# EAGLE schematic FPGA Test Board (EAGLE 9.2.0)
CREVISION: A; DESIGNER: Luis Ernesto Fdez

## Sheet 1 of 4: Comunication Interface
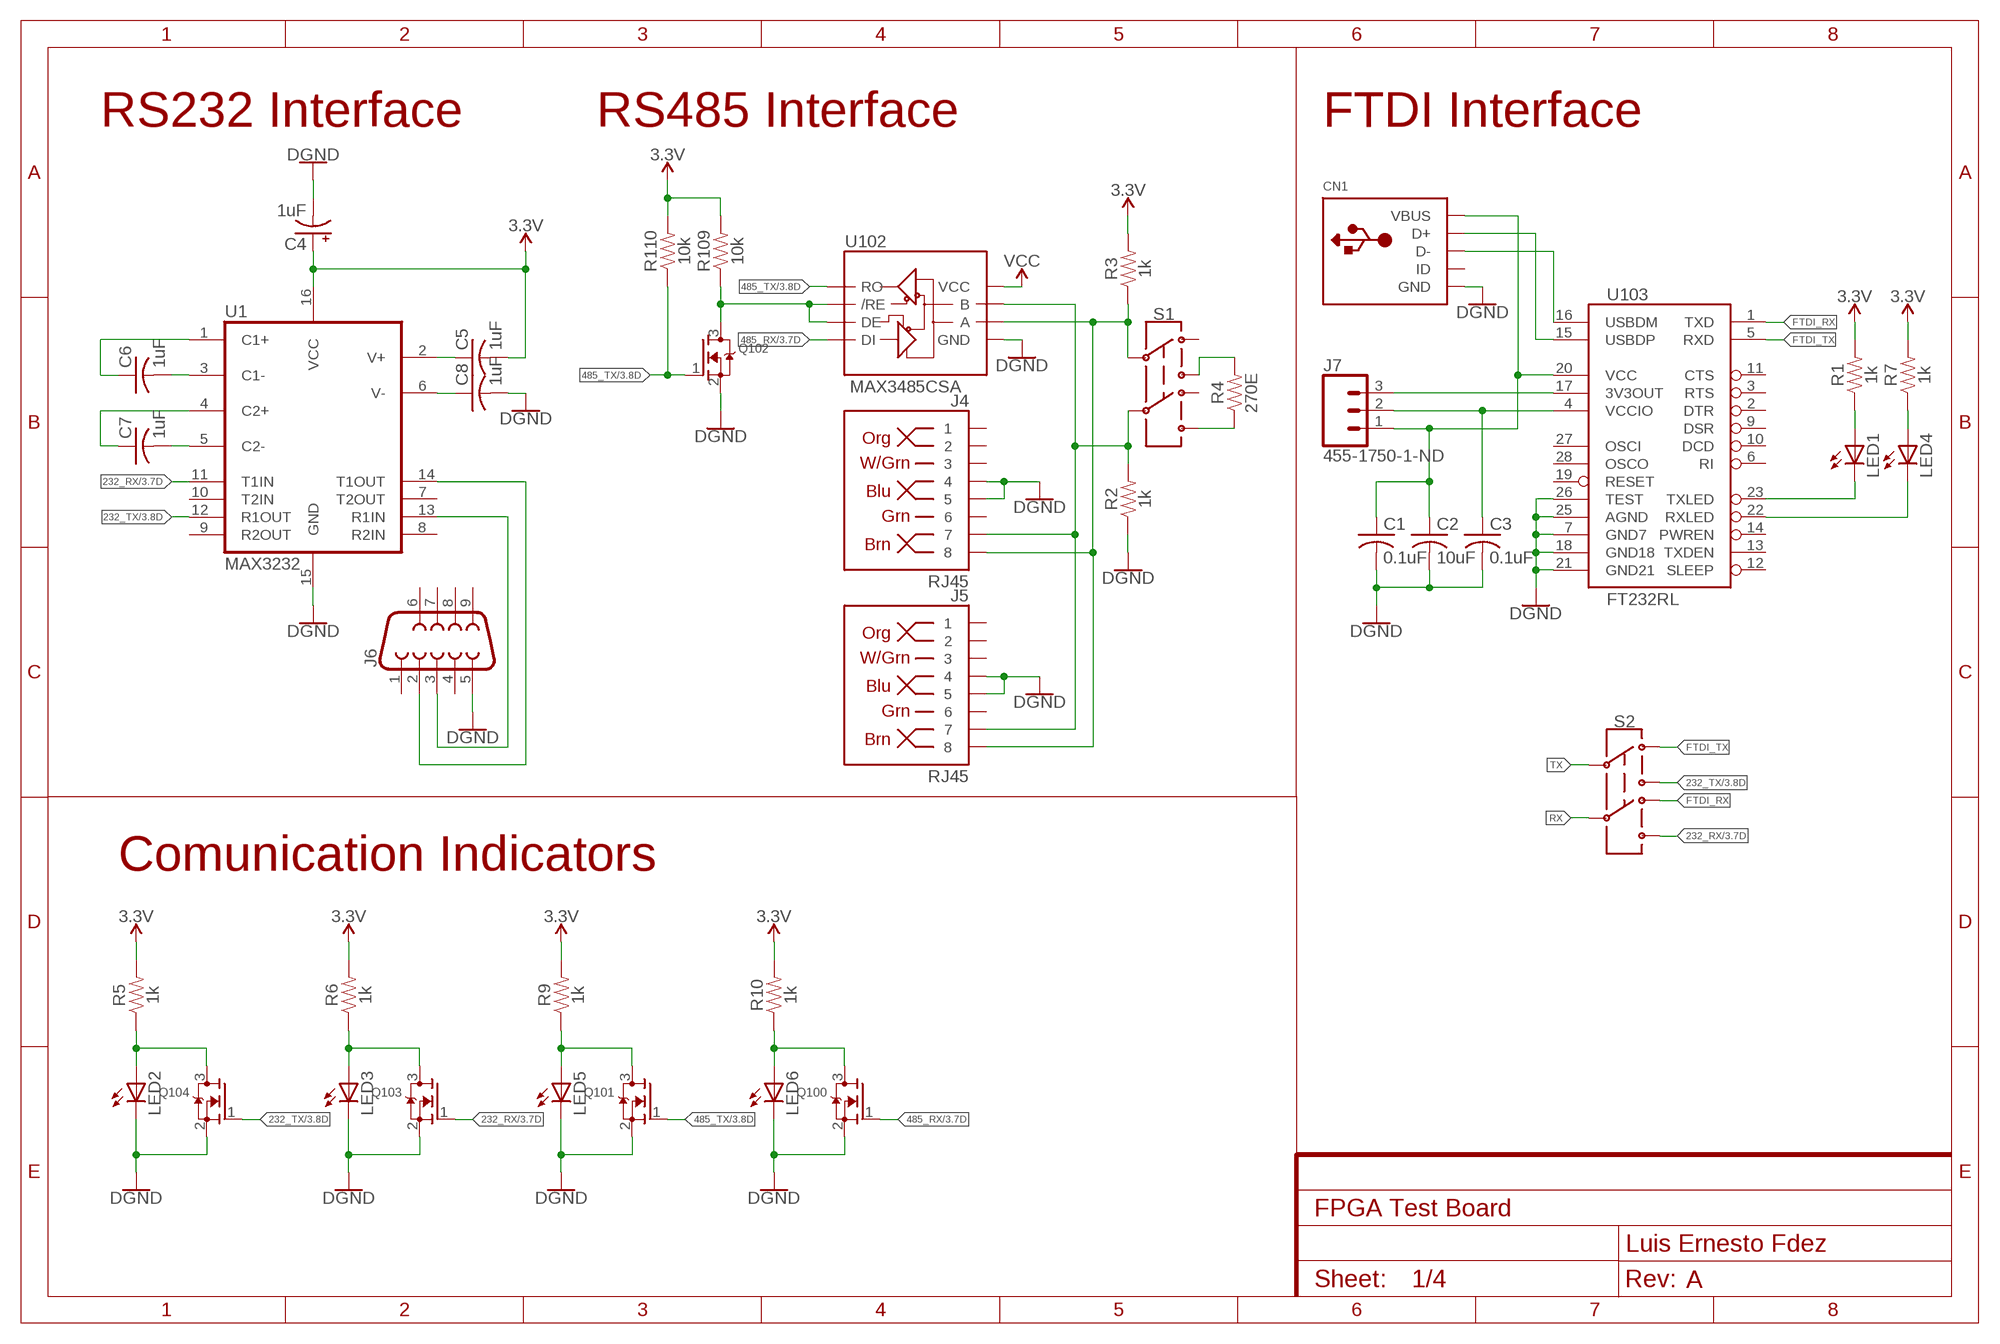
[diagram p0: schematic, sheet 1]

### Parts
C1  0.1uF  C-USC0805  [C0805]
C2  10uF  C-USC0805  [C0805]
C3  0.1uF  C-USC0805  [C0805]
C4  1uF  CPOL-USB  [PANASONIC_B]
C5  1uF  C-USC0805  [C0805]
C6  1uF  C-USC0805  [C0805]
C7  1uF  C-USC0805  [C0805]
C8  1uF  C-USC0805  [C0805]
CN1  USBMINIB  [USB-MINIB]
J4  RJ45  RJ45-8  [RJ45-8]
J5  RJ45  RJ45-8  [RJ45-8]
J6  DB9FEMALE  [DB9]
J7  455-1750-1-ND  CONN_03  [1X03]
LED1  LEDCHIP-LED0805  [CHIP-LED0805]
LED2  LEDCHIP-LED0805  [CHIP-LED0805]
LED3  LEDCHIP-LED0805  [CHIP-LED0805]
LED4  LEDCHIP-LED0805  [CHIP-LED0805]
LED5  LEDCHIP-LED0805  [CHIP-LED0805]
LED6  LEDCHIP-LED0805  [CHIP-LED0805]
Q100  MOSFET-NWAVE  [SOT23-W]
Q101  MOSFET-NWAVE  [SOT23-W]
Q102  MOSFET-NWAVE  [SOT23-W]
Q103  MOSFET-NWAVE  [SOT23-W]
Q104  MOSFET-NWAVE  [SOT23-W]
R1  1k  RESISTOR0805  [0805]
R2  1k  RESISTOR0805  [0805]
R3  1k  RESISTOR0805  [0805]
R4  270E  RESISTOR0805  [0805]
R5  1k  RESISTOR0805  [0805]
R6  1k  RESISTOR0805  [0805]
R7  1k  RESISTOR0805  [0805]
R9  1k  RESISTOR0805  [0805]
R10  1k  RESISTOR0805  [0805]
R109  10k  RESISTOR0805  [0805]
R110  10k  RESISTOR0805  [0805]
S1  SWITCH-DPDT-SMD-AYZ0202  [SWITCH_DPDT_SMD_AYZ0202]
S2  SWITCH-DPDT-SMD-AYZ0202  [SWITCH_DPDT_SMD_AYZ0202]
U1  MAX3232  MAX2323SOIC16  [SO16]
U102  MAX3485CSA  RS485SOIC  [SO08]
U103  FT232RL  FT232RLSSOP  [SSOP28DB]

### Nets
3.3V: C4.+ C5.2 R1.2 R3.2 R5.2 R6.2 R7.2 R9.2 R10.2 R109.2 R110.2 U1.16(VCC) ; also sheet 2,3,4
5V: U102.8(VCC) ; supply symbol labelled VCC ; also sheet 2,3,4
232_RX: Q103.1(G) S2.6 U1.11(T1IN) ; also sheet 3
232_TX: Q104.1(G) S2.3 U1.12(R1OUT) ; also sheet 3
485_RX: Q100.1(G) U102.4(DI) ; also sheet 3
485_TX: Q101.1(G) Q102.1(G) R110.1 U102.1(RO) ; also sheet 3
FTDI_RX: S2.4 U103.1(TXD)
FTDI_TX: S2.1 U103.5(RXD)
GND: C1.2 C2.2 C3.2 C4.- C8.2 CN1.GND J4.4 J4.5 J5.4 J5.5 J6.5 LED2.C LED3.C LED5.C LED6.C Q100.2(S) Q101.2(S) Q102.2(S) Q103.2(S) Q104.2(S) R2.1 U1.15(GND) U102.5(GND) U103.7(GND7) U103.18(GND18) U103.21(GND21) U103.25(AGND) U103.26(TEST) ; supply symbol labelled DGND ; also sheet 2,3
N$1: C6.2 U1.3(C1-)
N$2: C5.1 U1.2(V+)
N$3: C6.1 U1.1(C1+)
N$4: C7.1 U1.4(C2+)
N$5: C7.2 U1.5(C2-)
N$6: C8.1 U1.6(V-)
N$7: J4.8 J5.8 R3.1 S1.2 U102.6(A)
N$8: LED3.A Q103.3(D) R6.1
N$9: J6.2 U1.14(T1OUT)
N$10: J6.3 U1.13(R1IN)
N$11: LED5.A Q101.3(D) R9.1
N$12: LED2.A Q104.3(D) R5.1
N$13: LED6.A Q100.3(D) R10.1
N$14: J4.7 J5.7 R2.2 S1.5 U102.7(B)
N$15: R4.1 S1.6
N$16: Q102.3(D) R109.1 U102.2(/RE) U102.3(DE)
N$17: R4.2 S1.3
N$32: C1.1 C2.1 CN1.VBUS J7.1 U103.20(VCC)
N$34: LED1.A R1.1
N$35: LED1.C U103.23(TXLED)
N$36: LED4.A R7.1
N$46: LED4.C U103.22(RXLED)
N$47: CN1.D- U103.16(USBDM)
N$48: CN1.D+ U103.15(USBDP)
N$49: J7.3 U103.17(3V3OUT)
N$50: C3.1 J7.2 U103.4(VCCIO)
RX: S2.5
TX: S2.2
Unconnected: CN1.ID J4.1 J4.2 J4.3 J4.6 J5.1 J5.2 J5.3 J5.6 J6.1 J6.4 J6.6 J6.7 J6.8 J6.9 S1.1 S1.4 U1.7(T2OUT) U1.8(R2IN) U1.9(R2OUT) U1.10(T2IN) U103.2(DTR) U103.3(RTS) U103.6(RI) U103.9(DSR) U103.10(DCD) U103.11(CTS) U103.12(SLEEP) U103.13(TXDEN) U103.14(PWREN) U103.19(RESET) U103.27(OSCI) U103.28(OSCO)

### Notes on the sheet
- RS232 Interface | RS485 Interface | FTDI Interface
- Comunication Indicators

## Sheet 2 of 4: Input/Output Interface
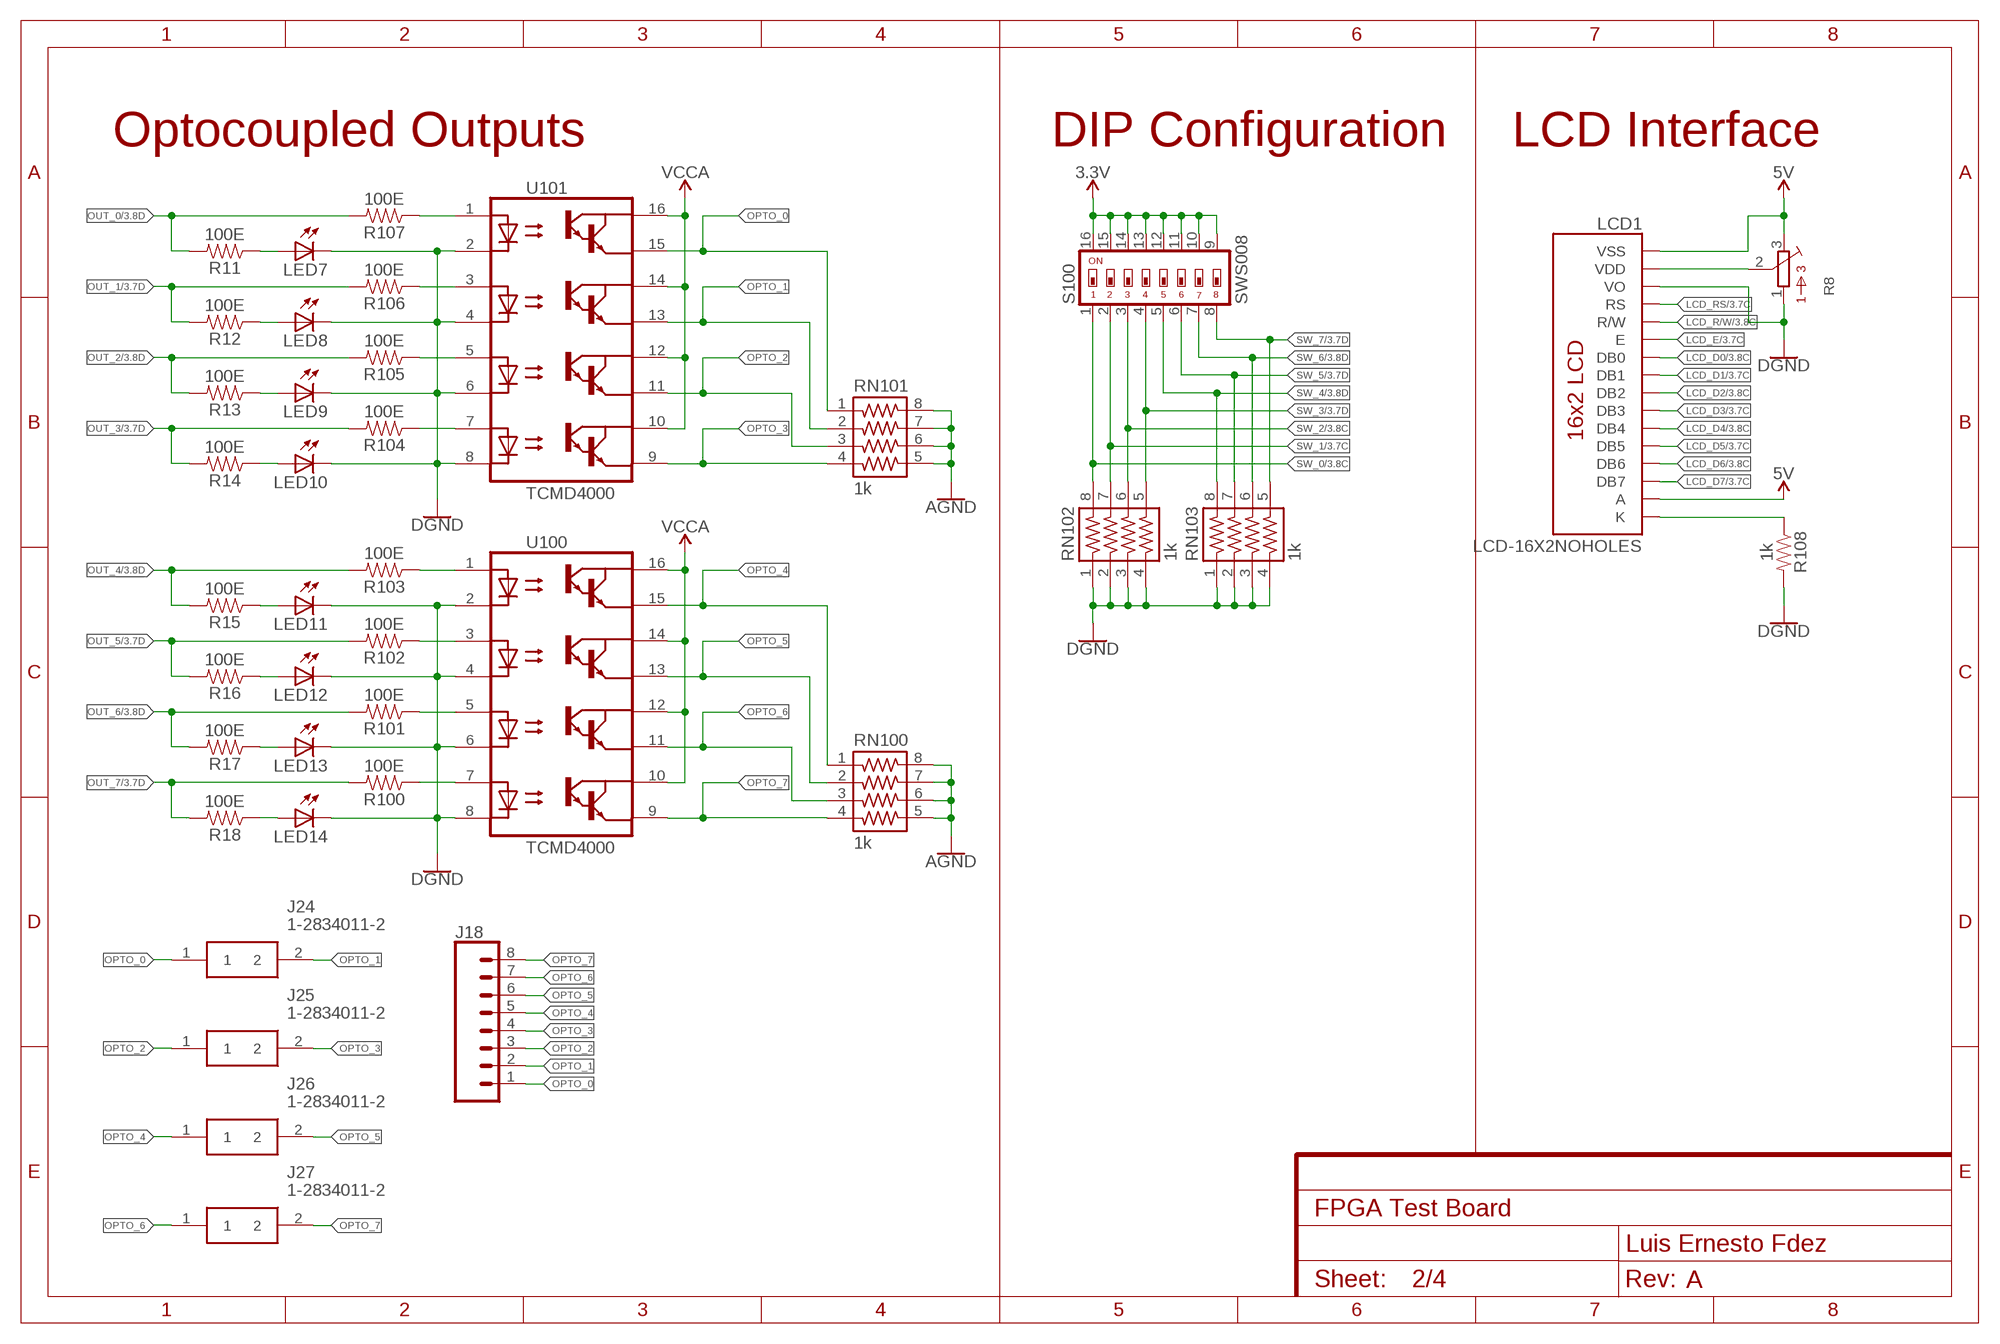
[diagram p1: schematic, sheet 2]

### Parts
J18  CONN_08FEMALE_LOCK  [1X08_FEMALE_LOCK]
J24  1-2834011-2  [128340112]
J25  1-2834011-2  [128340112]
J26  1-2834011-2  [128340112]
J27  1-2834011-2  [128340112]
LCD1  LCD-16X2NOHOLES  [LCD-16X2_NOHOLESNOSILK]
LED7  LEDCHIP-LED0805  [CHIP-LED0805]
LED8  LEDCHIP-LED0805  [CHIP-LED0805]
LED9  LEDCHIP-LED0805  [CHIP-LED0805]
LED10  LEDCHIP-LED0805  [CHIP-LED0805]
LED11  LEDCHIP-LED0805  [CHIP-LED0805]
LED12  LEDCHIP-LED0805  [CHIP-LED0805]
LED13  LEDCHIP-LED0805  [CHIP-LED0805]
LED14  LEDCHIP-LED0805  [CHIP-LED0805]
R8  3386-P  [3386P]
R11  100E  RESISTOR0805  [0805]
R12  100E  RESISTOR0805  [0805]
R13  100E  RESISTOR0805  [0805]
R14  100E  RESISTOR0805  [0805]
R15  100E  RESISTOR0805  [0805]
R16  100E  RESISTOR0805  [0805]
R17  100E  RESISTOR0805  [0805]
R18  100E  RESISTOR0805  [0805]
R100  100E  RESISTOR0805  [0805]
R101  100E  RESISTOR0805  [0805]
R102  100E  RESISTOR0805  [0805]
R103  100E  RESISTOR0805  [0805]
R104  100E  RESISTOR0805  [0805]
R105  100E  RESISTOR0805  [0805]
R106  100E  RESISTOR0805  [0805]
R107  100E  RESISTOR0805  [0805]
R108  1k  RESISTOR0805  [0805]
RN100  1k  743-8NS  [743-8NS]
RN101  1k  743-8NS  [743-8NS]
RN102  1k  743-8NS  [743-8NS]
RN103  1k  743-8NS  [743-8NS]
S100  SWS008  [SMS-008]
U100  TCMD4000  [SOIC127P686X201-16N]
U101  TCMD4000  [SOIC127P686X201-16N]

### Nets
3.3V: S100.9 S100.10 S100.11 S100.12 S100.13 S100.14 S100.15 S100.16 ; also sheet 1,3,4
5V: LCD1.1(VSS) LCD1.15(A) R8.3 ; also sheet 1,3,4
AGND: RN100.5 RN100.6 RN100.7 RN100.8 RN101.5 RN101.6 RN101.7 RN101.8 ; also sheet 4
GND: LCD1.3(VO) LED7.C LED8.C LED9.C LED10.C LED11.C LED12.C LED13.C LED14.C R8.1 R108.2 RN102.1 RN102.2 RN102.3 RN102.4 RN103.1 RN103.2 RN103.3 RN103.4 U100.2(C1) U100.4(C2) U100.6(C3) U100.8(C4) U101.2(C1) U101.4(C2) U101.6(C3) U101.8(C4) ; supply symbol labelled DGND ; also sheet 1,3
LCD_D0: LCD1.7(DB0) ; also sheet 3
LCD_D1: LCD1.8(DB1) ; also sheet 3
LCD_D2: LCD1.9(DB2) ; also sheet 3
LCD_D3: LCD1.10(DB3) ; also sheet 3
LCD_D4: LCD1.11(DB4) ; also sheet 3
LCD_D5: LCD1.12(DB5) ; also sheet 3
LCD_D6: LCD1.13(DB6) ; also sheet 3
LCD_D7: LCD1.14(DB7) ; also sheet 3
LCD_E: LCD1.6(E) ; also sheet 3
LCD_R/W: LCD1.5(R/W) ; also sheet 3
LCD_RS: LCD1.4(RS) ; also sheet 3
N$18: LCD1.2(VDD) R8.2
N$19: LCD1.16(K) R108.1
N$20: R107.1 U101.1(A1)
N$21: R106.1 U101.3(A2)
N$22: R105.1 U101.5(A3)
N$23: R104.1 U101.7(A4)
N$25: LED10.A R14.1
N$26: LED9.A R13.1
N$27: LED8.A R12.1
N$28: LED7.A R11.1
N$33: R103.1 U100.1(A1)
N$39: R102.1 U100.3(A2)
N$40: R101.1 U100.5(A3)
N$41: R100.1 U100.7(A4)
N$42: LED14.A R18.1
N$43: LED13.A R17.1
N$44: LED12.A R16.1
N$45: LED11.A R15.1
OPTO_0: J18.1 J24.1 RN101.1 U101.15(E1)
OPTO_1: J18.2 J24.2 RN101.2 U101.13(E2)
OPTO_2: J18.3 J25.1 RN101.3 U101.11(E3)
OPTO_3: J18.4 J25.2 RN101.4 U101.9(E4)
OPTO_4: J18.5 J26.1 RN100.1 U100.15(E1)
OPTO_5: J18.6 J26.2 RN100.2 U100.13(E2)
OPTO_6: J18.7 J27.1 RN100.3 U100.11(E3)
OPTO_7: J18.8 J27.2 RN100.4 U100.9(E4)
OUT_0: R11.2 R107.2 ; also sheet 3
OUT_1: R12.2 R106.2 ; also sheet 3
OUT_2: R13.2 R105.2 ; also sheet 3
OUT_3: R14.2 R104.2 ; also sheet 3
OUT_4: R15.2 R103.2 ; also sheet 3
OUT_5: R16.2 R102.2 ; also sheet 3
OUT_6: R17.2 R101.2 ; also sheet 3
OUT_7: R18.2 R100.2 ; also sheet 3
SW_0: RN102.8 S100.1 ; also sheet 3
SW_1: RN102.7 S100.2 ; also sheet 3
SW_2: RN102.6 S100.3 ; also sheet 3
SW_3: RN102.5 S100.4 ; also sheet 3
SW_4: RN103.8 S100.5 ; also sheet 3
SW_5: RN103.7 S100.6 ; also sheet 3
SW_6: RN103.6 S100.7 ; also sheet 3
SW_7: RN103.5 S100.8 ; also sheet 3
VCCA: U100.10(CO4) U100.12(CO3) U100.14(CO2) U100.16(CO1) U101.10(CO4) U101.12(CO3) U101.14(CO2) U101.16(CO1) ; also sheet 4

### Notes on the sheet
- Optocoupled Outputs | DIP Configuration | LCD Interface

## Sheet 3 of 4: ADC & External I/O
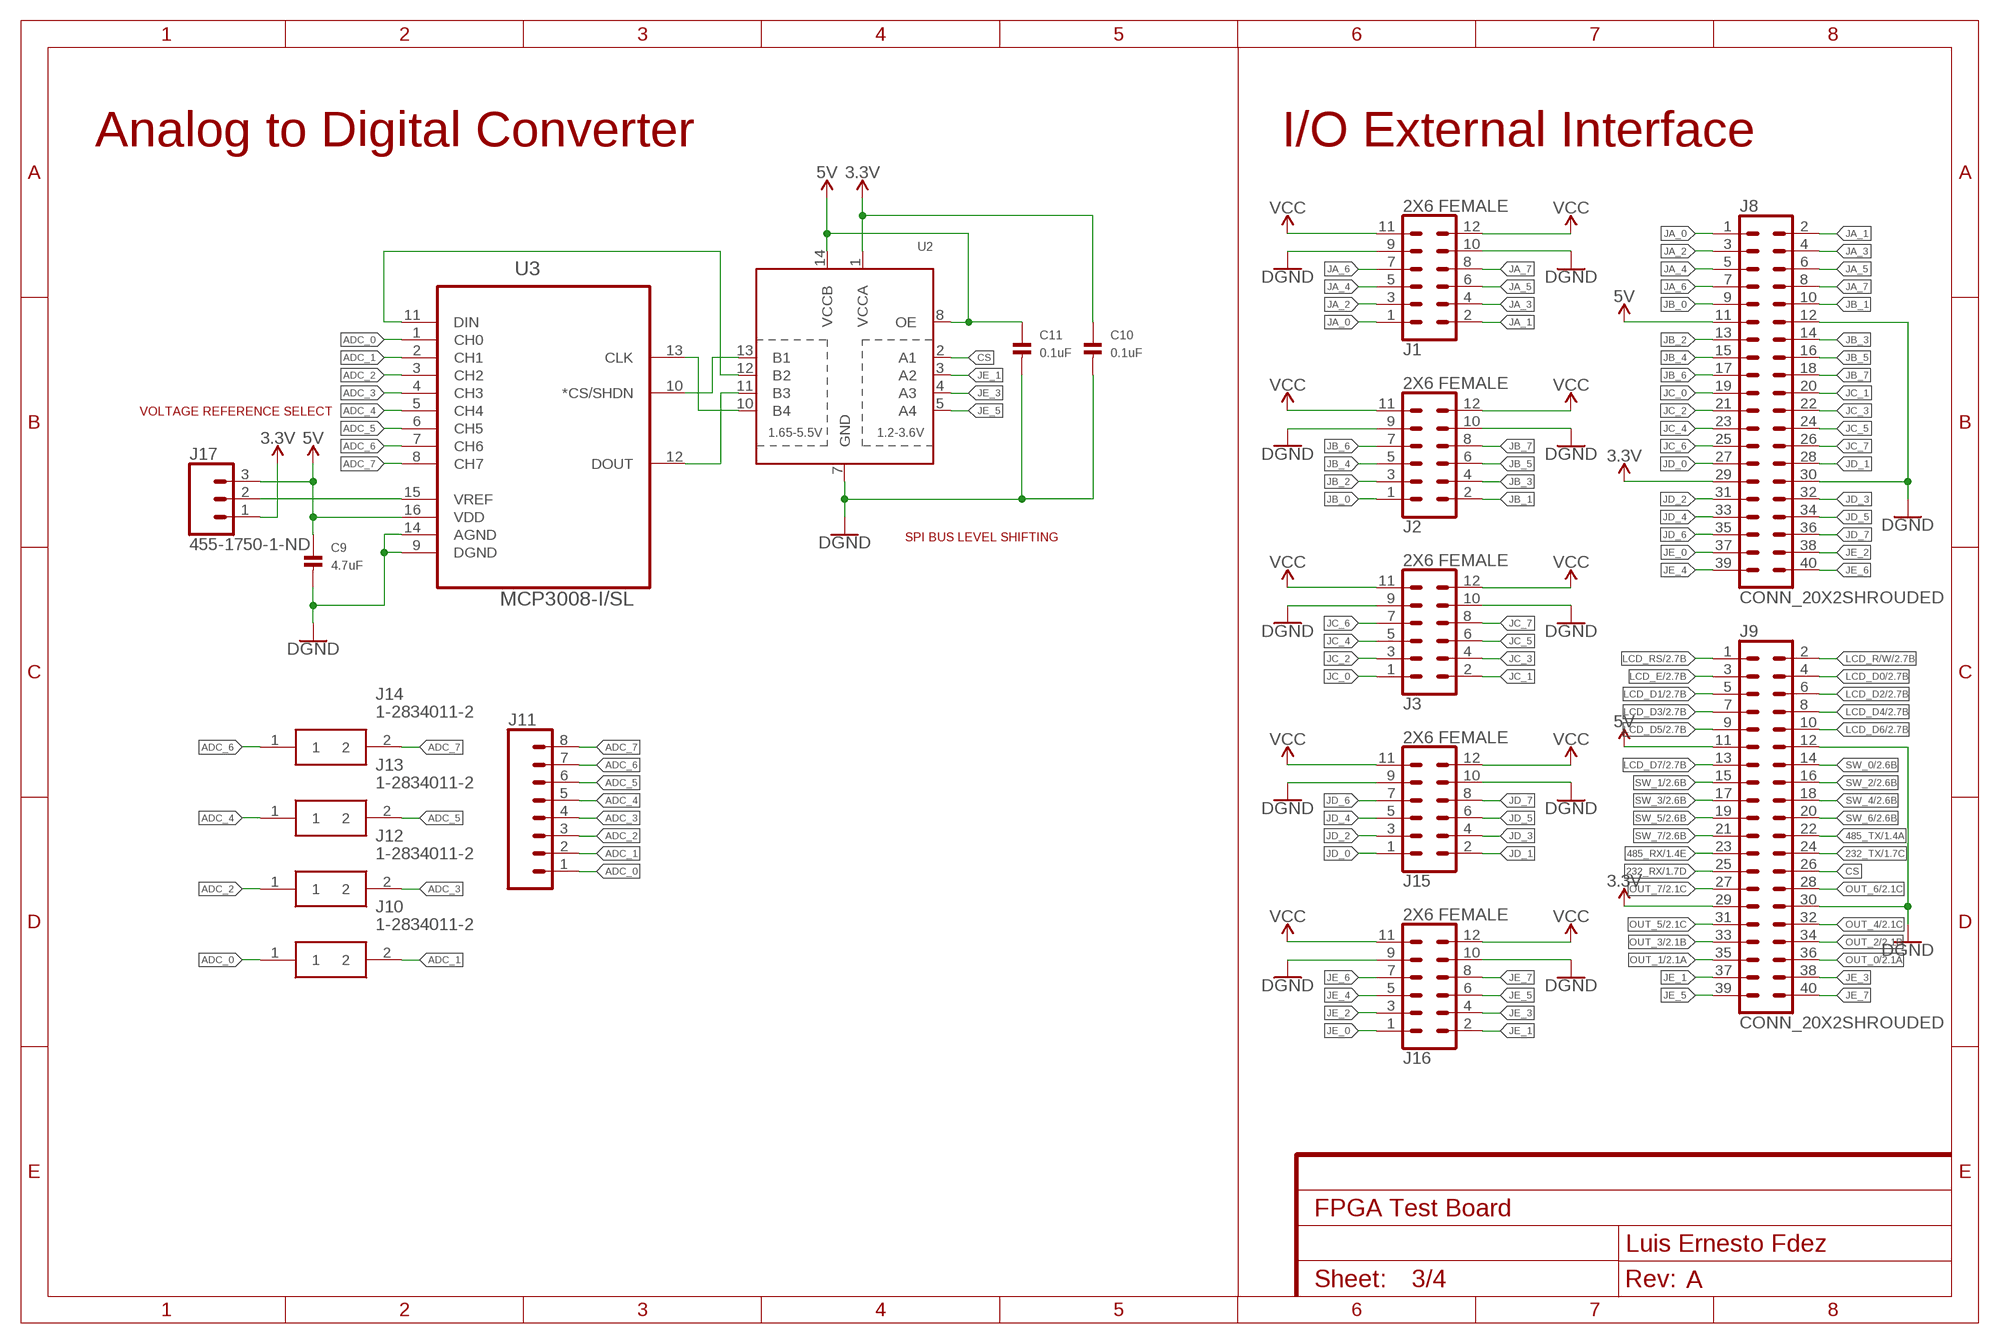
[diagram p2: schematic, sheet 3]

### Parts
C9  4.7uF  CAP_CERAMIC0805-NOTHERMALS  [0805_NOTHERMALS]
C10  0.1uF  CAP_CERAMIC0805-NOTHERMALS  [0805_NOTHERMALS]
C11  0.1uF  CAP_CERAMIC0805-NOTHERMALS  [0805_NOTHERMALS]
J1  2X6 FEMALE  CONN_06X2PTH_FEMALE  [2X6]
J2  2X6 FEMALE  CONN_06X2PTH_FEMALE  [2X6]
J3  2X6 FEMALE  CONN_06X2PTH_FEMALE  [2X6]
J8  CONN_20X2SHROUDED  [2X20_SHROUDED]
J9  CONN_20X2SHROUDED  [2X20_SHROUDED]
J10  1-2834011-2  [128340112]
J11  CONN_08FEMALE_LOCK  [1X08_FEMALE_LOCK]
J12  1-2834011-2  [128340112]
J13  1-2834011-2  [128340112]
J14  1-2834011-2  [128340112]
J15  2X6 FEMALE  CONN_06X2PTH_FEMALE  [2X6]
J16  2X6 FEMALE  CONN_06X2PTH_FEMALE  [2X6]
J17  455-1750-1-ND  CONN_03  [1X03]
U2  TXB0104PWR  [TSSOP14]
U3  MCP3008-I/SL  [SOIC127P600X175-16N]

### Nets
3.3V: C10.1 J8.29 J9.29 J17.1 U2.1(VCCA) ; also sheet 1,2,4
5V: C9.1 C11.1 J8.11 J9.11 J17.3 U2.8(OE) U2.14(VCCB) U3.16(VDD) ; also sheet 1,2,4
232_RX: J9.25 ; also sheet 1
232_TX: J9.24 ; also sheet 1
485_RX: J9.23 ; also sheet 1
485_TX: J9.22 ; also sheet 1
ADC_0: J10.1 J11.1 U3.1(CH0)
ADC_1: J10.2 J11.2 U3.2(CH1)
ADC_2: J11.3 J12.1 U3.3(CH2)
ADC_3: J11.4 J12.2 U3.4(CH3)
ADC_4: J11.5 J13.1 U3.5(CH4)
ADC_5: J11.6 J13.2 U3.6(CH5)
ADC_6: J11.7 J14.1 U3.7(CH6)
ADC_7: J11.8 J14.2 U3.8(CH7)
CS: J9.26 U2.2(A1)
GND: C9.2 C10.2 C11.2 J1.9 J1.10 J2.9 J2.10 J3.9 J3.10 J8.12 J8.30 J9.12 J9.30 J15.9 J15.10 J16.9 J16.10 U2.7(GND) U3.9(DGND) U3.14(AGND) ; supply symbol labelled DGND ; also sheet 1,2
JA_0: J1.1 J8.1
JA_1: J1.2 J8.2
JA_2: J1.3 J8.3
JA_3: J1.4 J8.4
JA_4: J1.5 J8.5
JA_5: J1.6 J8.6
JA_6: J1.7 J8.7
JA_7: J1.8 J8.8
JB_0: J2.1 J8.9
JB_1: J2.2 J8.10
JB_2: J2.3 J8.13
JB_3: J2.4 J8.14
JB_4: J2.5 J8.15
JB_5: J2.6 J8.16
JB_6: J2.7 J8.17
JB_7: J2.8 J8.18
JC_0: J3.1 J8.19
JC_1: J3.2 J8.20
JC_2: J3.3 J8.21
JC_3: J3.4 J8.22
JC_4: J3.5 J8.23
JC_5: J3.6 J8.24
JC_6: J3.7 J8.25
JC_7: J3.8 J8.26
JD_0: J8.27 J15.1
JD_1: J8.28 J15.2
JD_2: J8.31 J15.3
JD_3: J8.32 J15.4
JD_4: J8.33 J15.5
JD_5: J8.34 J15.6
JD_6: J8.35 J15.7
JD_7: J8.36 J15.8
JE_0: J8.37 J16.1
JE_1: J9.37 J16.2 U2.3(A2)
JE_2: J8.38 J16.3
JE_3: J9.38 J16.4 U2.4(A3)
JE_4: J8.39 J16.5
JE_5: J9.39 J16.6 U2.5(A4)
JE_6: J8.40 J16.7
JE_7: J9.40 J16.8
LCD_D0: J9.4 ; also sheet 2
LCD_D1: J9.5 ; also sheet 2
LCD_D2: J9.6 ; also sheet 2
LCD_D3: J9.7 ; also sheet 2
LCD_D4: J9.8 ; also sheet 2
LCD_D5: J9.9 ; also sheet 2
LCD_D6: J9.10 ; also sheet 2
LCD_D7: J9.13 ; also sheet 2
LCD_E: J9.3 ; also sheet 2
LCD_R/W: J9.2 ; also sheet 2
LCD_RS: J9.1 ; also sheet 2
N$24: U2.13(B1) U3.10(*CS/SHDN)
N$29: U2.10(B4) U3.13(CLK)
N$31: U2.11(B3) U3.12(DOUT)
N$94: U2.12(B2) U3.11(DIN)
N$112: J17.2 U3.15(VREF)
OUT_0: J9.36 ; also sheet 2
OUT_1: J9.35 ; also sheet 2
OUT_2: J9.34 ; also sheet 2
OUT_3: J9.33 ; also sheet 2
OUT_4: J9.32 ; also sheet 2
OUT_5: J9.31 ; also sheet 2
OUT_6: J9.28 ; also sheet 2
OUT_7: J9.27 ; also sheet 2
SW_0: J9.14 ; also sheet 2
SW_1: J9.15 ; also sheet 2
SW_2: J9.16 ; also sheet 2
SW_3: J9.17 ; also sheet 2
SW_4: J9.18 ; also sheet 2
SW_5: J9.19 ; also sheet 2
SW_6: J9.20 ; also sheet 2
SW_7: J9.21 ; also sheet 2
VCC: J1.11 J1.12 J2.11 J2.12 J3.11 J3.12 J15.11 J15.12 J16.11 J16.12 ; also sheet 4

### Notes on the sheet
- Analog to Digital Converter | I/O External Interface
- VOLTAGE REFERENCE SELECT
- SPI BUS LEVEL SHIFTING

## Sheet 4 of 4: Power Delivery
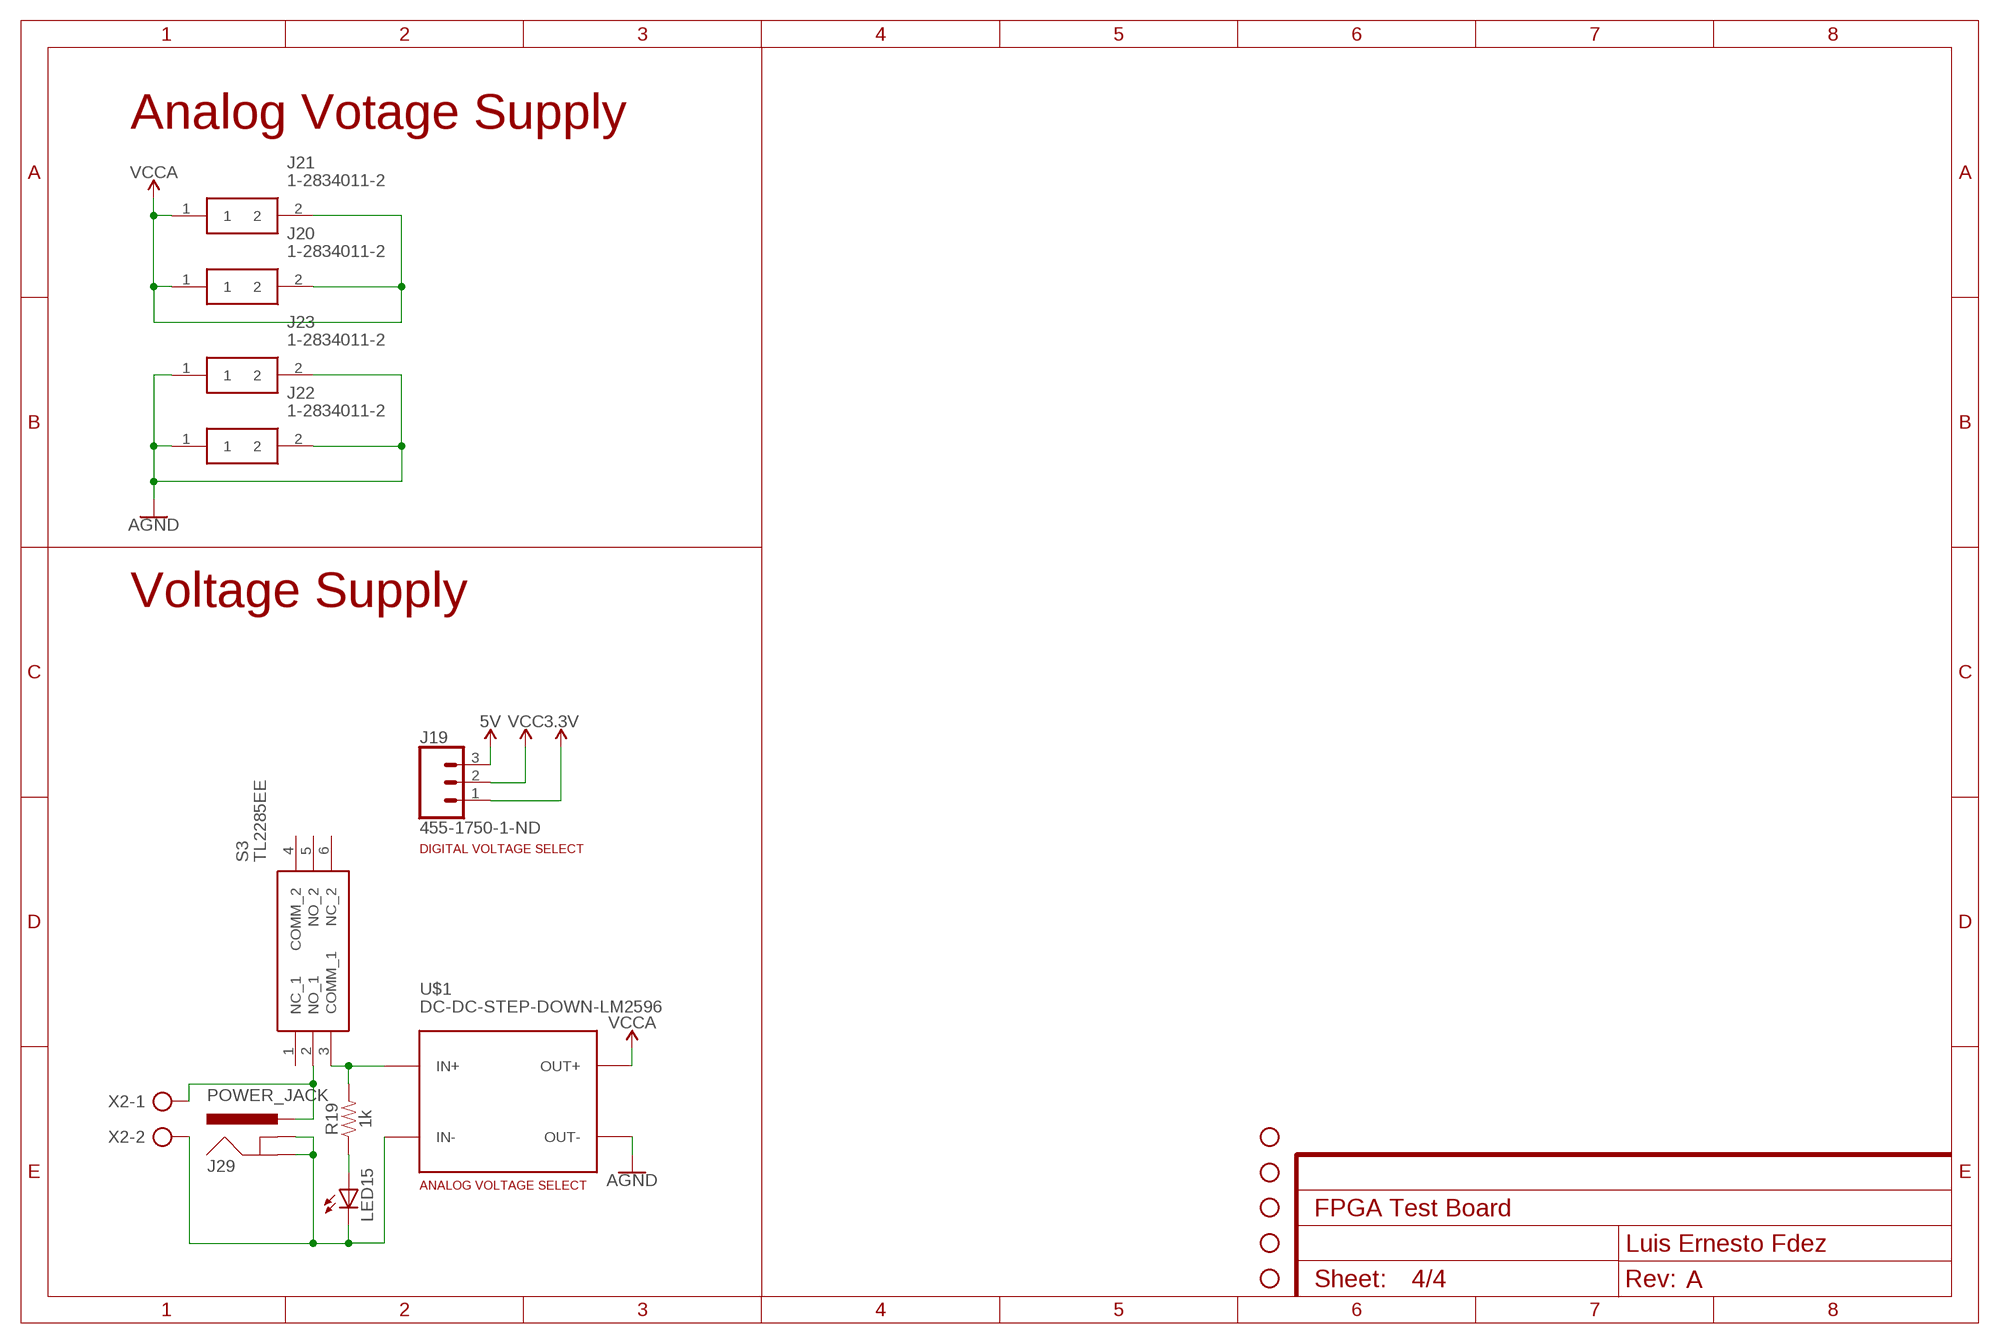
[diagram p3: schematic, sheet 4]

### Parts
H1  STAND-OFF  [STAND-OFF]
H5  STAND-OFF  [STAND-OFF]
H6  STAND-OFF  [STAND-OFF]
H7  STAND-OFF  [STAND-OFF]
H8  STAND-OFF  [STAND-OFF]
J19  455-1750-1-ND  CONN_03  [1X03]
J20  1-2834011-2  [128340112]
J21  1-2834011-2  [128340112]
J22  1-2834011-2  [128340112]
J23  1-2834011-2  [128340112]
J29  POWER_JACK  [POWER_JACK_PTH]
LED15  LEDCHIP-LED0805  [CHIP-LED0805]
R19  1k  RESISTOR0805  [0805]
S3  TL2285EE  [TL2285EE]
U$1  DC-DC-STEP-DOWN-LM2596  [DC-DC-STEP-DOWN-LM2596]
X2  AK500/2-H  [AK500/2-H]

### Nets
3.3V: J19.1 ; also sheet 1,2,3
5V: J19.3 ; also sheet 1,2,3
AGND: J22.1 J22.2 J23.1 J23.2 U$1.OUT- ; also sheet 2
N$97: R19.2 S3.3(COMM_1) U$1.IN+
N$98: LED15.A R19.1
N$100: J29.PWR S3.2(NO_1) X2.1
N$101: J29.GND J29.GNDBREAK LED15.C U$1.IN- X2.2
VCC: J19.2 ; also sheet 3
VCCA: J20.1 J20.2 J21.1 J21.2 U$1.OUT+ ; also sheet 2
Unconnected: S3.1(NC_1) S3.4(COMM_2) S3.5(NO_2) S3.6(NC_2)

### Notes on the sheet
- Analog Votage Supply
- Voltage Supply
- DIGITAL VOLTAGE SELECT
- ANALOG VOLTAGE SELECT

## Library data of the parts
C1-C3 C5-C8 = adafruit:C-US: CAPACITOR, American symbol
C4 = adafruit:CPOL-US: POLARIZED CAPACITOR, American symbol
C9-C11 = microbuilder:CAP_CERAMIC: Ceramic Capacitors 0402 - 0402 Surface Mount Capacitors 16pF 50V 5% [Digikey: 445-4899-2-ND] 18pF 50V 5% [Digikey: 490-1281-2-ND] 22pF 50V 5% [Digikey: 490-1283-2-ND] 68pF 50V 5% [Digikey: 490-1289-2-ND] 0.1uF 10V 10% [Digikey: 490-1318-2-ND] 1.0uF 6.3V 10% [Digikey: 490-1320-2-ND] 0603 - 0603 Surface Mount Capacitors 16 pF 50V 5% [Digikey: 445-5051-2-ND] 22 pF 50V [Digikey: PCC220ACVTR-ND] 33 pF 50V 5% [Digikey: 490-1415-1-ND] 56pF 50V 5% [Digikey: 490-1421-1-ND] 220pF 50V 5% [Digikey: 445-1285-1-ND] 680 pF 50V 2200 pF 50V 5% C0G [Digikey: 445-1297-1-ND] 5600 pF 100V 5% X7R [Digikey: 478-3711-1-ND] 0.1 µF 25V 10% [Digikey: PCC2277TR-ND] 0.22 µF 16V 10% X7R [Digikey: 445-1318-1-ND] 1.0 µF 25V 10% [Digikey: 445-5146-2-ND] 0603 - RF Specific 3pF 250V +/-0.1pF RF [Digikey: 712-1347-1-ND] 18 pF 250V 5% [Digikey: 478-3505-1-ND or 712-1322-1-ND] 56 pF 250V 5% C0G RF [Digikey: 490-4867-1-ND] 68 pF 250V RF [Digikey: 490-4868-1-ND] 0805 - 0805 Surface Mount Capacitors 220 pF 250V 2% RF Ceramic Capacitor [Digikey: 712-1398-1-ND] 1000 pF 50V 2% NP0 Ceramic Capacitor [Digikey: 478-3760-1-ND] 0.1 µF 25V 10% Ceramic Capacitor [Digikey: PCC1828TR-ND] 1.0 µF 16V 10% Ceramic Capacitor[Digikey: 490-1691-2-ND] 10.0 µF 10V 10% Ceramic Capacitor[Digikey: 709-1228-1-ND] 10.0 uF 16V 10% Ceramic Capacitor [Digikey: 478-5165-2-ND] 47 uF 6.3V 20% Ceramic Capacitor [Digikey: 587-1779-1-ND or 399-5506-1-ND] 1206 - 1206 Surface Mount Capacitors 47uF 10V 20% Ceramic Capacitor [Digikey: 490-5528-1-ND or 399-5508-1-ND or 445-6010-1-ND] 100uF 6.3V -20%, +80% Y5V Ceramic Capacitor (Digikey: 490-4512-1-ND, Mouser: 81-GRM31CF50J107ZE1L)
CN1 = adafruit:USB: USB Connectors USBMINIB - Surface Mount Female Mini-B USB Connector 4UConnector: 06564 By microbuilder.eu Thru-hole RA Female Mini-B USB Connector 4UConnector: 18732 By ladyada.net
H1 H5-H8 = SparkFun-Hardware:STAND-OFF: Stand Off Drill holes for mechanically mounting via screws, standoffs, etc. Note: Use the keepout ring to avoid running the screw head into surrounding components. Variant Overviews STAND-OFF - Mechanical footprint for a #4 phillips button head screw. STAND-OFF-TIGHT - Mechanical footprint for a #4 phillips button head screw, Example SparkFun Products Screw - Phillips Head (1/4", 4-40, 10 pack) <https://www.sparkfun.com/products/10453> (PRT-10453) Screw - Phillips Head (1/2", 4-40, 10 pack) <https://www.sparkfun.com/products/10452> (PRT-10452) Screw - Phillips Head (3/4", 4-40, 10 pack) <https://www.sparkfun.com/products/10451> (PRT-10451) Screw - Phillips Head (1", 4-40, 10 pack) <https://www.sparkfun.com/products/10450> (PRT-10450)
J1-J3 J15 J16 = SparkFun-Connectors:CONN_06X2: Multi connection point. Often used as Generic Header-pin footprint for 0.1 inch spaced/style header connections On any of the 0.1 inch spaced packages, you can populate with these: Break Away Headers - Straight <https://www.sparkfun.com/products/116> (PRT-00116) Break Away Male Headers - Right Angle <https://www.sparkfun.com/products/553> (PRT-00553) Female Headers <https://www.sparkfun.com/products/115> (PRT-00115) Break Away Headers - Machine Pin <https://www.sparkfun.com/products/117> (PRT-00117) Break Away Female Headers - Swiss Machine Pin <https://www.sparkfun.com/products/743> (PRT-00743); PROD_ID: CONN-12423
J4 J5 = SparkFun-Connectors:RJ45-8: RJ45 Jack - 8 pin Simple RJ45, 8-pin connection. Commonly used for Cat5, Cat5e, and Cat6 Ethernet cables. Here is the connector we sell at SparkFun: RJ45 8-Pin Connector <https://www.sparkfun.com/products/643> (PRT-00643) Datasheet <https://cdn.sparkfun.com/datasheets/Prototyping/04908.pdf> It is used on this SparkFun product: SparkFun RJ45 Breakout <https://www.sparkfun.com/products/716> (BOB-00716) Note, you may also be interested in the "MAGJACK" version of this. It is basically a RJ45 connector, but also has some status LEDs built into the connector housing. You can check that out in this library at the device named "MAGJACK.dev" and see these products online: RJ45 Ethernet MagJack-Compatible <https://www.sparkfun.com/products/8534> (PRT-08534) SparkFun RJ45 MagJack Breakout <https://www.sparkfun.com/products/13021> (BOB-13021); PROD_ID: CONN-08506; SF_ID: PRT-00643
J6 = SparkFun-Connectors:DB9: DB9 Connector Standard DB9 (D-Sub 9) serial connector. Can be used for CAN bus as well as RS485 and RS232. Footprint production proven. Here is the female version connector we sell at SparkFun: 9 Pin Female Serial Connector - PCB Mount <https://www.sparkfun.com/products/429> (PRT-00429) This connector has been used on the following SparkFun products: SparkFun RS232 Shifter - SMD <https://www.sparkfun.com/products/449> (PRT-00449) SparkFun RS232 Shifter SMD (No DB9) <https://www.sparkfun.com/products/8780> (PRT-08780); PROD_ID: CONN-08194
J7 J17 J19 = SparkFun-Connectors:CONN_03: Multi connection point. Often used as Generic Header-pin footprint for 0.1 inch spaced/style header connections On any of the 0.1 inch spaced packages, you can populate with these: Break Away Headers - Straight <https://www.sparkfun.com/products/116> (PRT-00116) Break Away Male Headers - Right Angle <https://www.sparkfun.com/products/553> (PRT-00553) Female Headers <https://www.sparkfun.com/products/115> (PRT-00115) Break Away Headers - Machine Pin <https://www.sparkfun.com/products/117> (PRT-00117) Break Away Female Headers - Swiss Machine Pin <https://www.sparkfun.com/products/743> (PRT-00743) Stackable Header - 3 Pin (Female, 0.1") <https://www.sparkfun.com/products/13875> (PRT-13875) For SCREWTERMINALS and SPRING TERMINALS visit here: Screw Terimnals on SparkFun.com <https://www.sparkfun.com/search/results?term=Screw+Terminals> (5mm/3.5mm/2.54mm spacing) This device is also useful as a general connection point to wire up your design to another part of your project. Our various solder wires solder well into these plated through hole pads. Hook-Up Wire - Assortment (Stranded, 22 AWG) <https://www.sparkfun.com/products/11375> (PRT-11375) Hook-Up Wire - Assortment (Solid Core, 22 AWG) <https://www.sparkfun.com/products/11367> (PRT-11367) View the entire wire category on our website here <https://www.sparkfun.com/categories/141> Special notes: Molex polarized connector foot print use with SKU : PRT-08232 with associated crimp pins and housings.; PROD_ID: XXX-00000
J8 J9 = SparkFun-Connectors:CONN_20X2: Multi connection point. Often used as Generic Header-pin footprint for 0.1 inch spaced/style header connections On any of the 0.1 inch spaced packages, you can populate with these: Break Away Headers - Straight <https://www.sparkfun.com/products/116> (PRT-00116) Break Away Male Headers - Right Angle <https://www.sparkfun.com/products/553> (PRT-00553) Female Headers <https://www.sparkfun.com/products/115> (PRT-00115) Break Away Headers - Machine Pin <https://www.sparkfun.com/products/117> (PRT-00117) Break Away Female Headers - Swiss Machine Pin <https://www.sparkfun.com/products/743> (PRT-00743); PROD_ID: CONN-12263; SF_ID: CONN-12263
J10 J12-J14 J20-J27 = 1-2834011-2:1-2834011-2: 2P 3.5mm Top Entry Screwless Connector. TE Connectivity 3.5mm Pitch Vertical PCB Terminal Block with Solder Termination, Through Hole, 2 Way Source: Datasheet <http://www.te.com/commerce/DocumentDelivery/DDEController?Action=showdoc&DocId=Customer Drawing2834011BpdfEnglishENG_CD_2834011_B.pdf1-2834011-2>; ARROW_PART_NUMBER: 1-2834011-2; ARROW_PRICE/STOCK: https://www.arrow.com/en/products/1-2834011-2/te-connectivity; DESCRIPTION: 2P 3.5mm Top Entry Screwless Connector. TE Connectivity 3.5mm Pitch Vertical PCB Terminal Block with Solder Termination, Through Hole, 2 Way; HEIGHT: 11mm; MANUFACTURER_NAME: TE Connectivity; MANUFACTURER_PART_NUMBER: 1-2834011-2; RS_PART_NUMBER: 1649131; RS_PRICE/STOCK: http://uk.rs-online.com/web/p/products/1649131
J11 J18 = SparkFun-Connectors:CONN_08: Multi connection point. Often used as Generic Header-pin footprint for 0.1 inch spaced/style header connections On any of the 0.1 inch spaced packages, you can populate with these: Break Away Headers - Straight <https://www.sparkfun.com/products/116> (PRT-00116) Break Away Male Headers - Right Angle <https://www.sparkfun.com/products/553> (PRT-00553) Female Headers <https://www.sparkfun.com/products/115> (PRT-00115) Break Away Headers - Machine Pin <https://www.sparkfun.com/products/117> (PRT-00117) Break Away Female Headers - Swiss Machine Pin <https://www.sparkfun.com/products/743> (PRT-00743) Arduino Stackable Header - 8 Pin <https://www.sparkfun.com/products/9279> (PRT-09279) For SCREWTERMINALS and SPRING TERMINALS visit here: Screw Terimnals on SparkFun.com <https://www.sparkfun.com/search/results?term=Screw+Terminals> (5mm/3.5mm/2.54mm spacing) This device is also useful as a general connection point to wire up your design to another part of your project. Our various solder wires solder well into these plated through hole pads. Hook-Up Wire - Assortment (Stranded, 22 AWG) <https://www.sparkfun.com/products/11375> (PRT-11375) Hook-Up Wire - Assortment (Solid Core, 22 AWG) <https://www.sparkfun.com/products/11367> (PRT-11367) View the entire wire category on our website here <https://www.sparkfun.com/categories/141> Special notes: Molex polarized connector foot print use with SKU : PRT-08231 with associated crimp pins and housings. 1MM SMD Version SKU: PRT-10208 NOTES ON THE VARIANTS LOCK and LOCK_LONGPADS... This footprint was designed to help hold the alignment of a through-hole component (i.e. 6-pin header) while soldering it into place. You may notice that each hole has been shifted either up or down by 0.005 of an inch from it's more standard position (which is a perfectly straight line). This slight alteration caused the pins (the squares in the middle) to touch the edges of the holes. Because they are alternating, it causes a "brace" to hold the component in place. 0.005 has proven to be the perfect amount of "off-center" position when using our standard breakaway headers. Although looks a little odd when you look at the bare footprint, once you have a header in there, the alteration is very hard to notice. Also,if you push a header all the way into place, it is covered up entirely on the bottom side.; PROD_ID: CONN-09233; SF_ID: PRT-09279
J29 = SparkFun-Connectors:POWER_JACK: Power Jack Connector This is the standard 5.5mm barrel jack for power. The PTH is the most common, proven, reliable, footprint. The Slot footprint only works if the mill layer is transmitted to the PCB fab house so be warned. Here are the connectors we sell at SparkFun: DC Barrel Power Jack/Connector <https://www.sparkfun.com/products/119> (PRT-00119) DC Barrel Power Jack/Connector (SMD) <https://www.sparkfun.com/products/12748> (PRT-12748) DC Barrel Jack Adapter - Breadboard Compatible <https://www.sparkfun.com/products/10811> (PRT-10811) It is used on this SparkFun product (and many, many others): SparkFun RedBoard - Programmed with Arduino <https://www.sparkfun.com/products/12757> (DEV-12757) Also, if you need a mating power supply or connector, please check these out: Wall Adapter Power Supply - 9VDC 650mA <https://www.sparkfun.com/products/298> (TOL-00298) DC Barrel Jack Adapter - Male <https://www.sparkfun.com/products/10287> (PRT-10287); PROD_ID: CONN-08197
LCD1 = SparkFun-Displays:LCD-16X2: Standard text-only 16x2 parallel input LCD Basic 16 character by 2 line display. Typically utilizes the extremely common HD44780 parallel interface chipset SparkFun Products: Basic 16x2 Green <https://www.sparkfun.com/products/255> Basic 8x2 Green <https://www.sparkfun.com/products/11122>; SF_ID: LCD-00255
LED1-LED15 = adafruit:LED: LED OSRAM: - CHIPLED LG R971, LG N971, LY N971, LG Q971, LY Q971, LO R971, LY R971 LH N974, LH R974 LS Q976, LO Q976, LY Q976 LO Q996 - Hyper CHIPLED LW Q18S LB Q993, LB Q99A, LB R99A - SideLED LS A670, LO A670, LY A670, LG A670, LP A670 LB A673, LV A673, LT A673, LW A673 LH A674 LY A675 LS A676, LA A676, LO A676, LY A676, LW A676 LS A679, LY A679, LG A679 - Hyper Micro SIDELED® LS Y876, LA Y876, LO Y876, LY Y876 LT Y87S - SmartLED LW L88C, LW L88S LB L89C, LB L89S, LG L890 LS L89K, LO L89K, LY L89K LS L896, LA L896, LO L896, LY L896 - TOPLED LS T670, LO T670, LY T670, LG T670, LP T670 LSG T670, LSP T670, LSY T670, LOP T670, LYG T670 LG T671, LOG T671, LSG T671 LB T673, LV T673, LT T673, LW T673 LH T674 LS T676, LA T676, LO T676, LY T676, LB T676, LH T676, LSB T676, LW T676 LB T67C, LV T67C, LT T67C, LS T67K, LO T67K, LY T67K, LW E67C LS E67B, LA E67B, LO E67B, LY E67B, LB E67C, LV E67C, LT E67C LW T67C LS T679, LY T679, LG T679 LS T770, LO T770, LY T770, LG T770, LP T770 LB T773, LV T773, LT T773, LW T773 LH T774 LS E675, LA E675, LY E675, LS T675 LS T776, LA T776, LO T776, LY T776, LB T776 LHGB T686 LT T68C, LB T68C - Hyper Mini TOPLED® LB M676 - Mini TOPLED Santana® LG M470 LS M47K, LO M47K, LY M47K Source: http://www.osram.convergy.de/
Q100-Q104 = adafruit:MOSFET-N: N-Channel Mosfet 2N7002E - 60V 260mA SOT23 [Digikey: 2N7002ET1GOSTR-ND] - REEL BSH103 - 30V 850mA SOT23 [Digikey: 568-5013-1-ND]
R1-R7 R9-R19 R100-R110 = SparkFun-Resistors:RESISTOR: Generic Resistor Package
R8 = bourns:3386-: 3386 Series 3/8" Square Trimmer
RN100-RN103 = resistor-array:743-8: CTS 743 Series 8 Terminations, 4 Resistors
S1 S2 = SparkFun-Switches:SWITCH-DPDT: Double-Pole, Double-Throw (DPDT) Switch Double-pole, double-throw switches. Variant Overview PTH-GPI-152-3013 Used on SparkFun Geiger Counter <https://www.sparkfun.com/products/11345> SMD-AY0202 Surface Mount DPDT Switch <https://www.sparkfun.com/products/597> (COM-00597) Used on e.g. LilyPad Arduino USB - ATmega32U4 Board <https://www.sparkfun.com/products/12049>; PROD_ID: SWCH-08179; SF_SKU: COM-00597
S3 = TL2285EE:TL2285EE: Tactile Switches DPDT ALT ACT PC MNT Source: Datasheet <https://componentsearchengine.com/Datasheets/1/TL2285EE.pdf>; DESCRIPTION: Tactile Switches DPDT ALT ACT PC MNT; HEIGHT: 13mm; MANUFACTURER_NAME: E-Switch; MANUFACTURER_PART_NUMBER: TL2285EE; MOUSER_PART_NUMBER: 612-TL2285EE
S100 = smd-special:SWS008: SMD Dip Switch 8 pol.
U1 = SparkFun-IC-Comms:MAX2323: RS232 Transceiver This part covers 232 drivers that are compatible with the MAX3232. Sipex SP3232EB Datasheet <http://cdn.sparkfun.com/datasheets/Components/General%20IC/SP3232EBCA-L.pdf> SparkFun Products SOIC component <https://www.sparkfun.com/products/589> (COM-00589 / IC-08171) Retired DIP component (COM-00316 / IC-08446) SparkFun Transceiver Breakout - MAX3232 <https://www.sparkfun.com/products/11189> (BOB-11189) SparkFun XBee Explorer Serial <https://www.sparkfun.com/products/13225> (WRL-13225); PROD_ID: IC-08171
U2 = adafruit:TXB0104PWR: 4-Bit Bi-Directional Level Shifter 1.2V-3.6V (VCCA) to 1.65V-5.5V (VCCB) bi-directional level shifter with auto direction sensing. Max data rate - VCCA 1.8V: 20Mbps (50ns), VCCA 3.3V: 100Mbps (10ns) Digikey: 296-21929-1-ND
U3 = MCP3008-I_SL:MCP3008-I/SL: 10BIT ADC, 8 CH, SPI, SMD; AVAILABILITY: Good; DESCRIPTION: Eight Channel SPI Serial Interface 2.7 V 10-Bit A/D Converter SMT - SOIC-16; MF: Microchip; MP: MCP3008-I/SL; PACKAGE: SOIC-16 Microchip; PRICE: 2.09 USD
U100 U101 = TCMD4000:TCMD4000: Optocoupler, Photodarlington Output, High Gain, Single/Quad Channel, Half Pitch Mini-Flat Package; AVAILABILITY: Good; DESCRIPTION: TCMD4000 Series Quad Channel 35V 3750 Vrms Photodarlington Optocoupler - SOIC-16; MF: Vishay Semiconductor; MP: TCMD4000; PACKAGE: SOP-16 Vishay Semiconductor; PRICE: 1.38 USD
U102 = SparkFun-IC-Comms:RS485: RS-485 Transceiver SP3485 Series 8 Pin NSOIC 3.3 V Low Power Half Duplex RS-485 Transceiver MAX3485 compatible Datasheet <http://www.sparkfun.com/datasheets/Components/General/sp3485CN-LTR.pdf> SparkFun Products SparkFun Transceiver Breakout - RS-485 <https://www.sparkfun.com/products/10124> (BOB-10124) SparkFun USB to RS-485 Converter <https://www.sparkfun.com/products/9822> (BOB-09822); PROD_ID: IC-09388
U103 = SparkFun-IC-Comms:FT232RL: FT232RL USB UART FT232RL 4th Generation USB UART (USB <-> Serial) Controller. Datasheet <http://www.sparkfun.com/datasheets/IC/FT232R_v104.pdf> SparkFun Products Component <https://www.sparkfun.com/products/650> (COM-00650) SparkFun RedBot Mainboard <https://www.sparkfun.com/products/12097> (ROB-12097) SparkFun FTDI Basic Breakout - 5V <https://www.sparkfun.com/products/9716> (DEV-09716) SparkFun FTDI Basic Breakout - 3.3V <https://www.sparkfun.com/products/9873> (DEV-09873) Bus Pirate - v3.6a <https://www.sparkfun.com/products/12942> (TOL-12942) SparkFun USB to Serial Breakout - FT232RL <https://www.sparkfun.com/products/12731> (BOB-12731) SparkFun PicoBoard <https://www.sparkfun.com/products/11888> (WIG-11888) SparkFun RFID USB Reader <https://www.sparkfun.com/products/9963> (SEN-09963) LilyPad FTDI Basic Breakout - 5V <https://www.sparkfun.com/products/10275> (DEV-10275) SparkFun Stepoko <https://www.sparkfun.com/products/13899> (ROB-13899); PROD_ID: IC-00870
U$1 = diy-modules:DC-DC-STEP-DOWN-LM2596: DC/DC Step-Down Regulator based on LM2596-ADJ chip LM2596 datasheet available here: http://www.ti.com/lit/ds/symlink/lm2596.pdf Click here to find device on ebay.com <http://www.ebay.com/sch/lm2596+power+regulator>
X2 = con-ptr500:AK500/2-H: CONNECTOR Aug. 2004 / PTR Meßtechnik: Die Bezeichnung der Serie AK505 wurde geändert. Es handelt sich hierbei um AK500 in horizontaler Ausführung.; OC_FARNELL: unknown; OC_NEWARK: unknown

## Net classes
1 power: width 0.254 mm